# EAGLE schematic VUEQ (2) v31 (EAGLE 9.7.0)
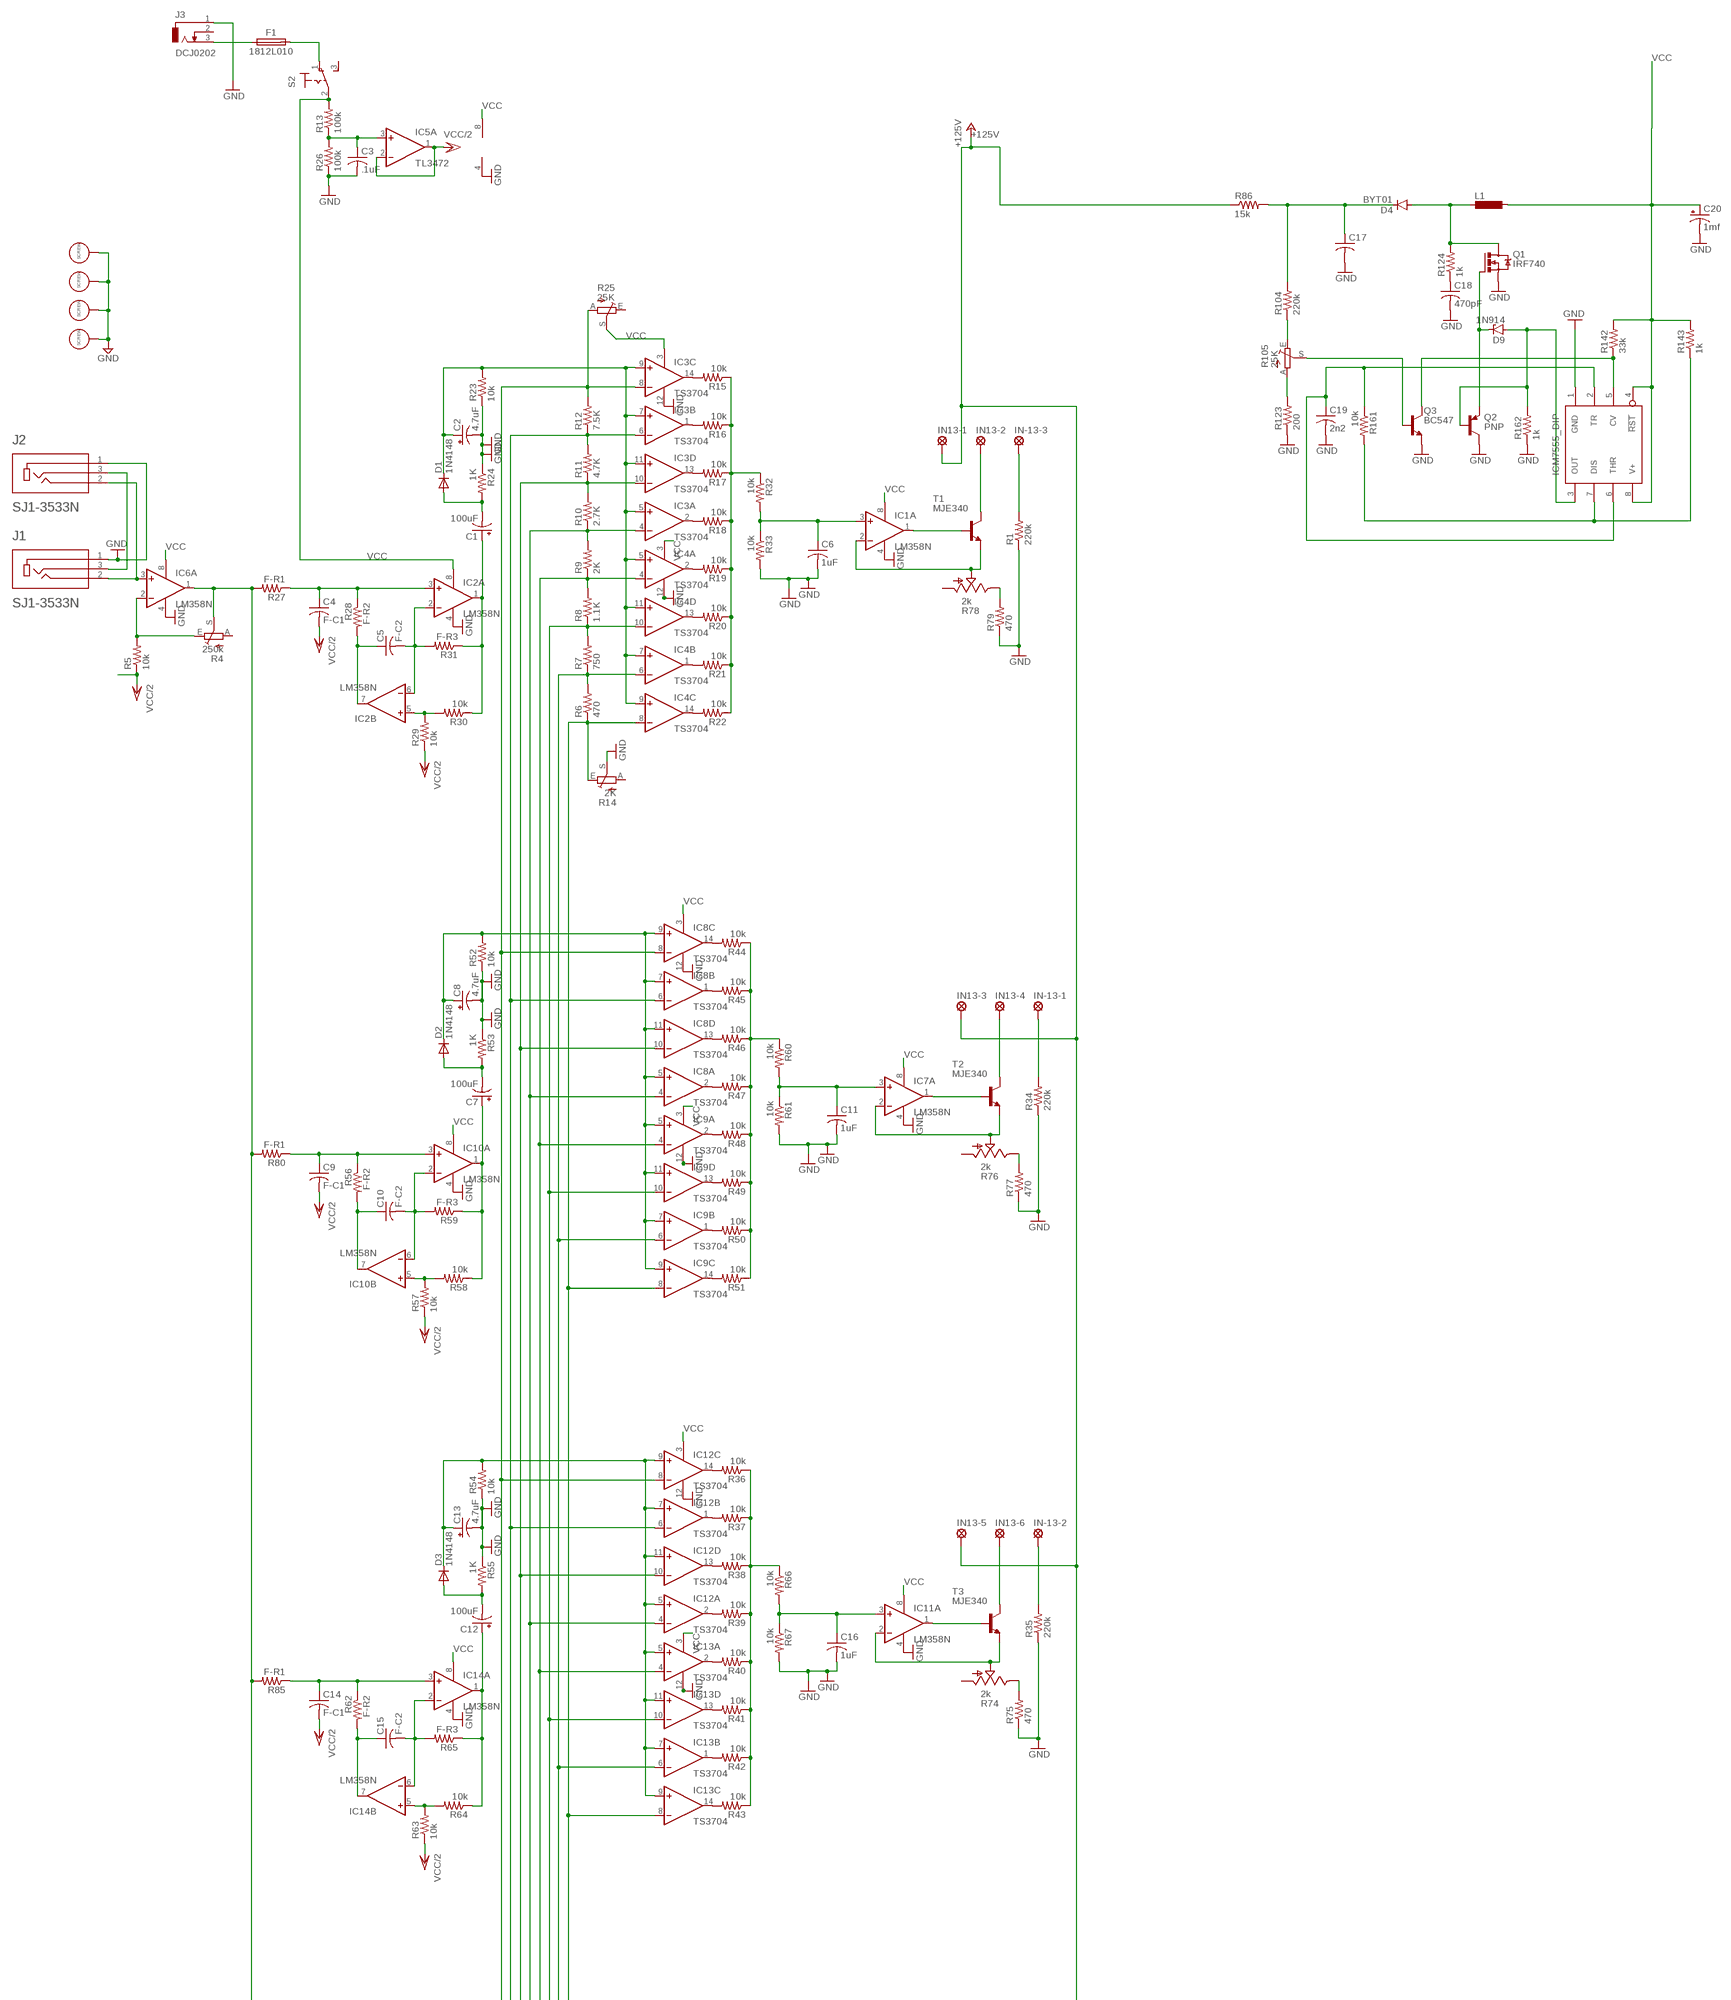
[diagram p0: schematic, sheet 1, part 1 of 3]
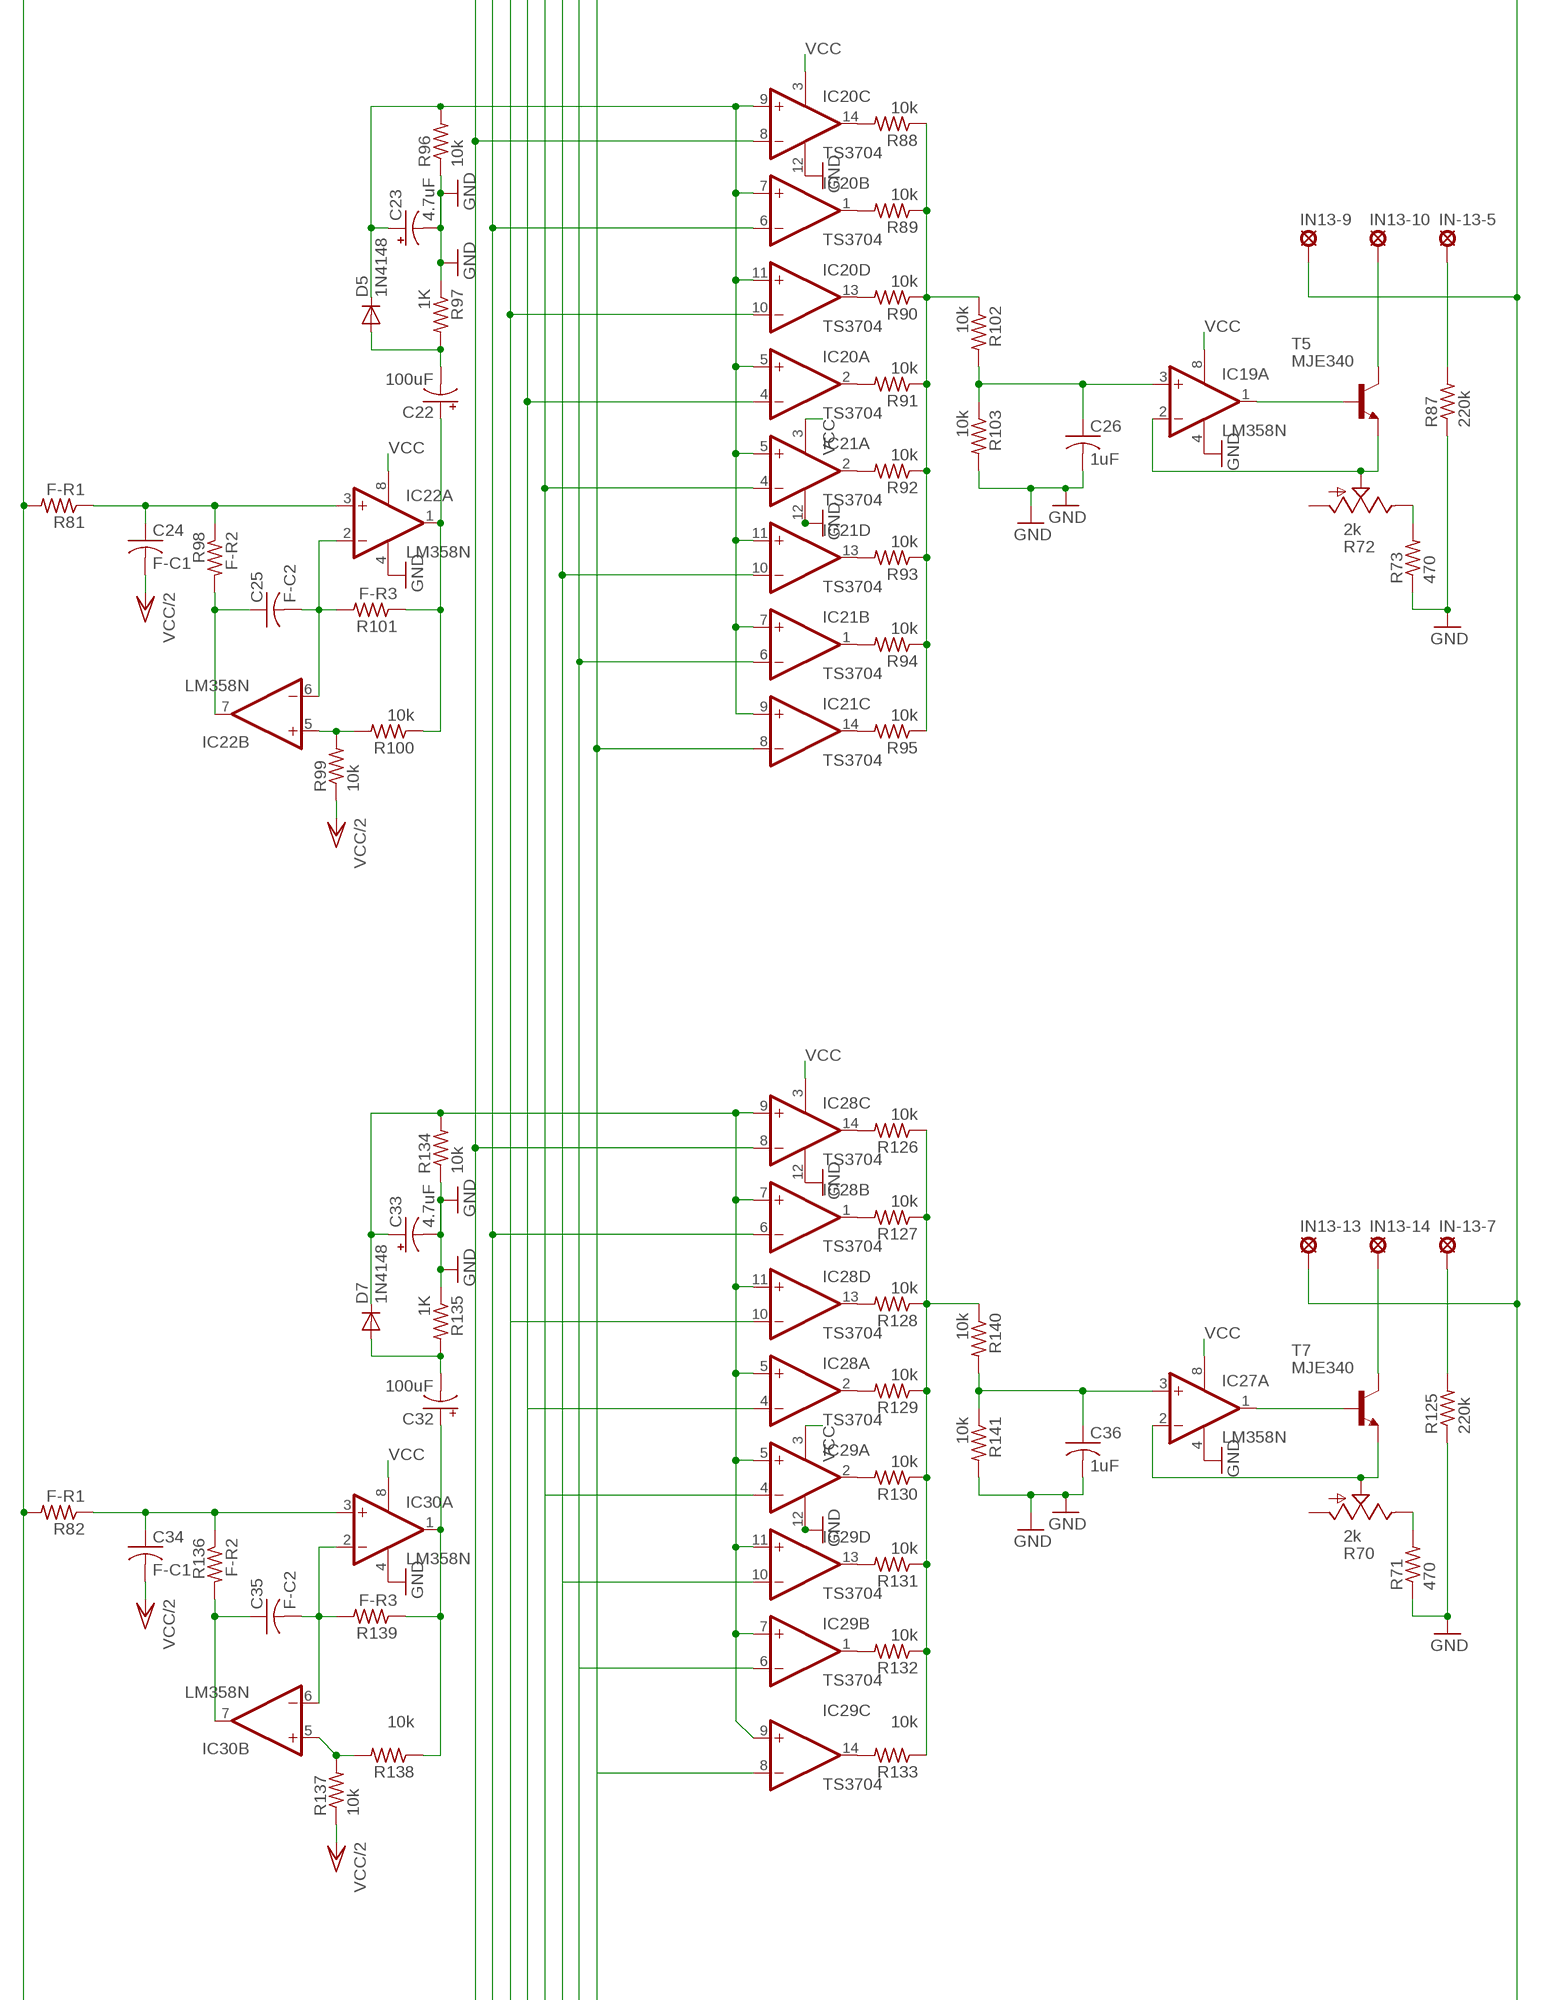
[diagram p1: schematic, sheet 1, part 2 of 3]
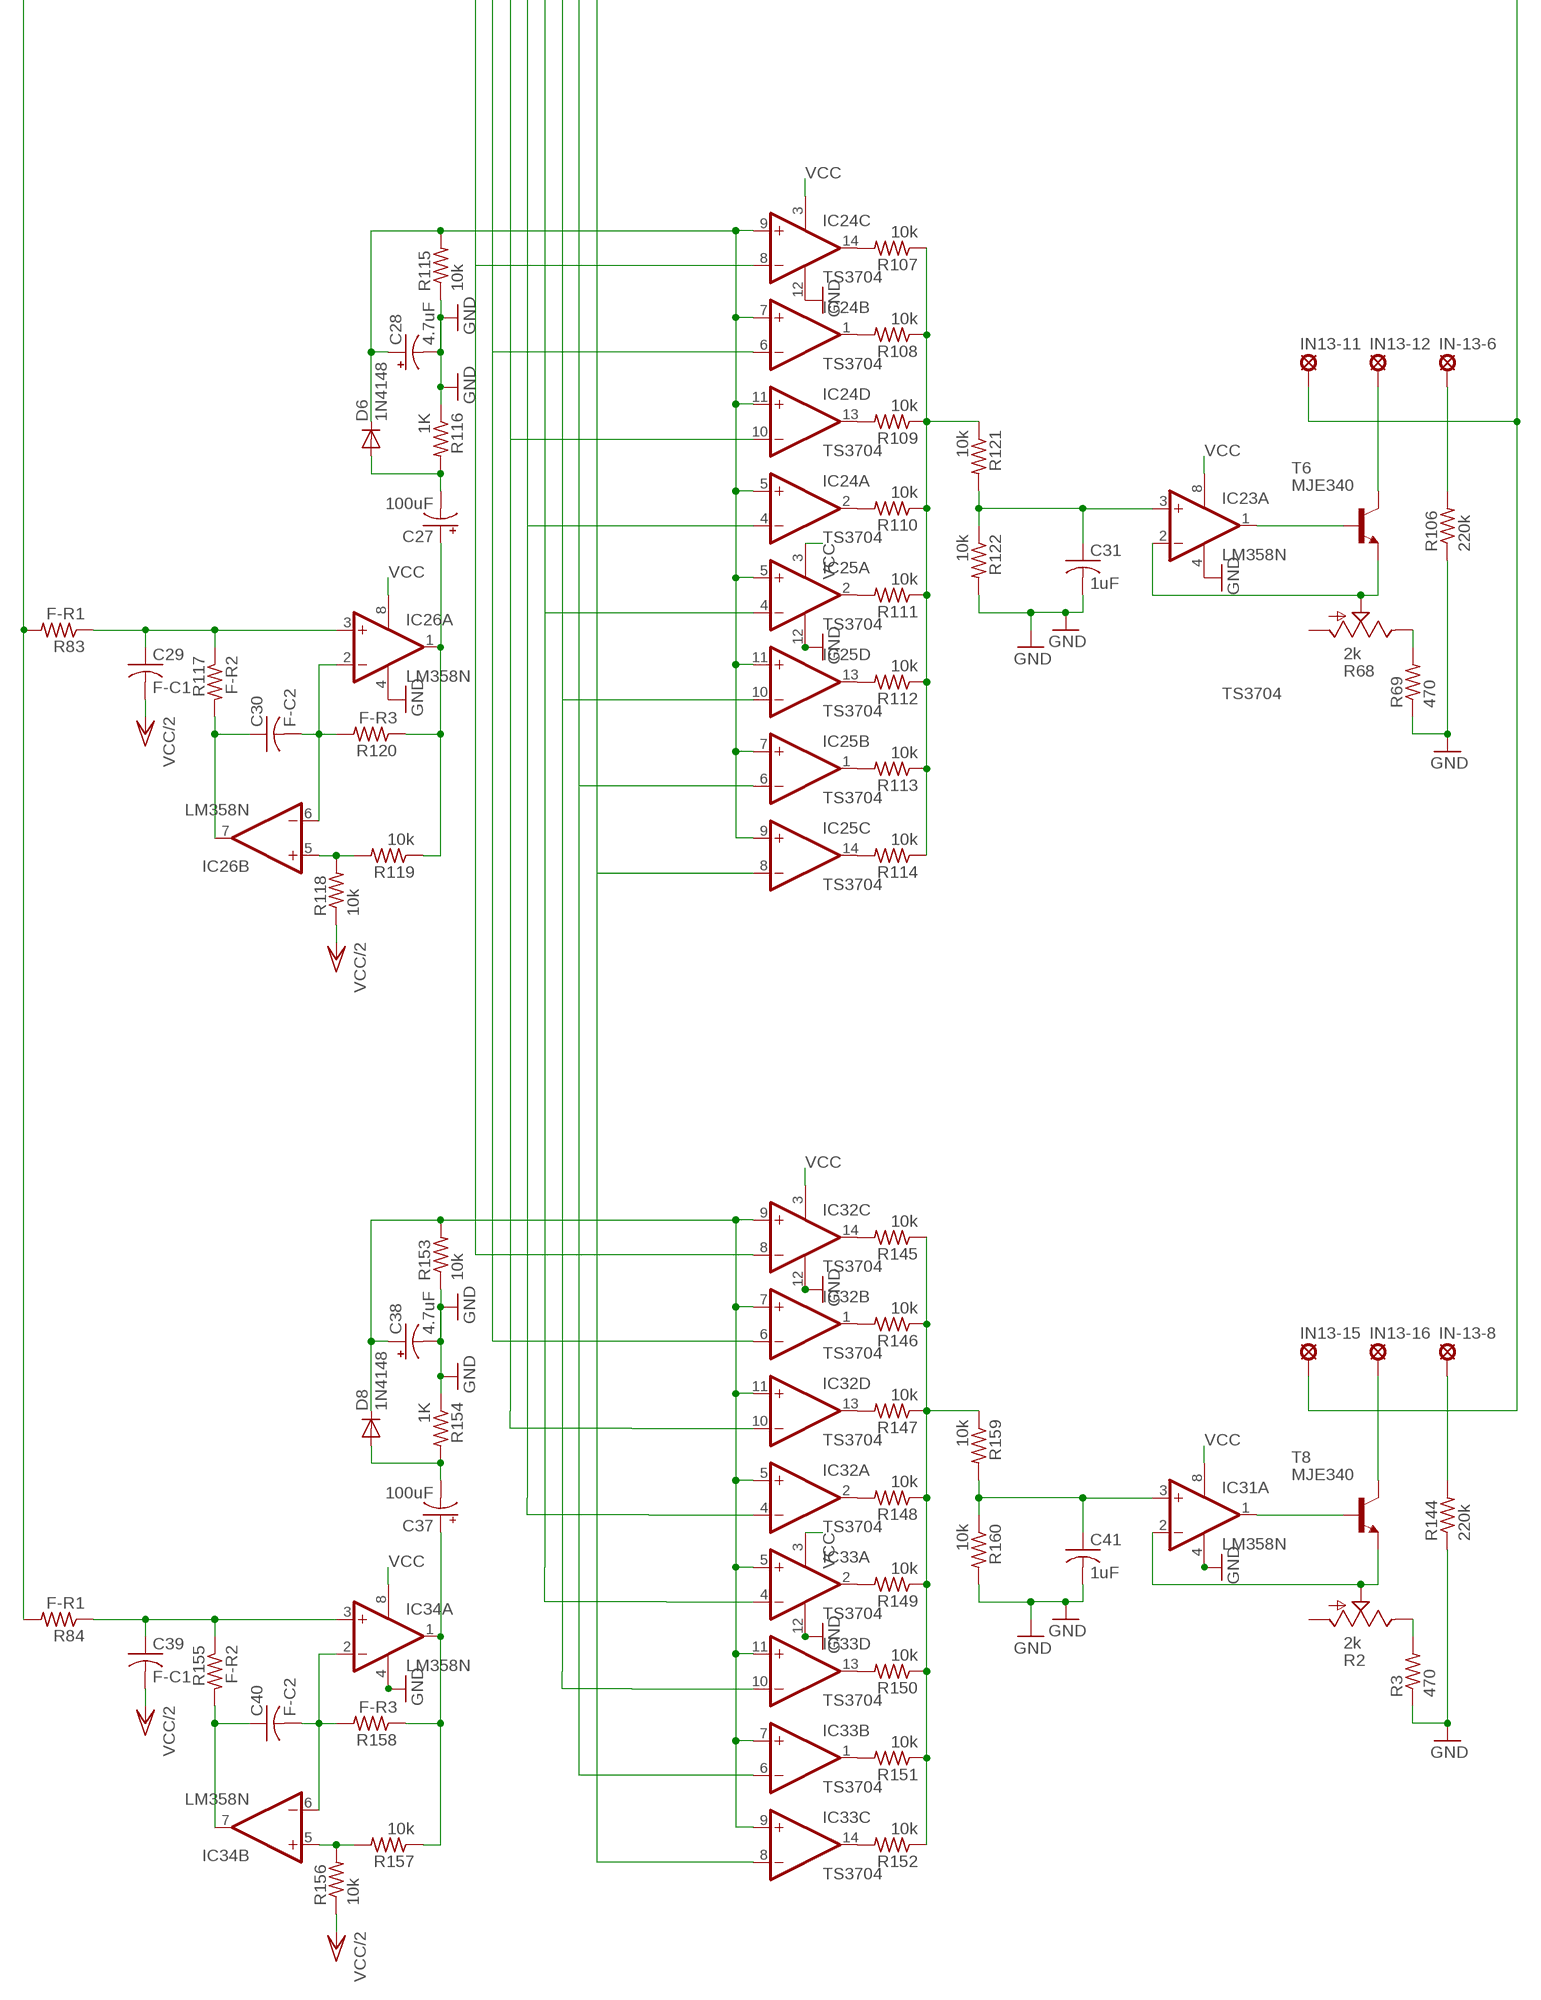
[diagram p2: schematic, sheet 1, part 3 of 3]

## Parts
C1  100uF  CPOL-USE2.5-5  [E2,5-5]
C2  4.7uF  CPOL-USE1.8-4  [E1,8-4]
C3  .1uF  C-US025-025X050  [C025-025X050]
C4  F-C1  C-US025-025X050  [C025-025X050]
C5  F-C2  C-US025-025X050  [C025-025X050]
C6  1uF  C-US025-024X044  [C025-024X044]
C7  100uF  CPOL-USE2.5-5  [E2,5-5]
C8  4.7uF  CPOL-USE1.8-4  [E1,8-4]
C9  F-C1  C-US025-025X050  [C025-025X050]
C10  F-C2  C-US025-025X050  [C025-025X050]
C11  1uF  C-US025-024X044  [C025-024X044]
C12  100uF  CPOL-USE2.5-5  [E2,5-5]
C13  4.7uF  CPOL-USE1.8-4  [E1,8-4]
C14  F-C1  C-US025-025X050  [C025-025X050]
C15  F-C2  C-US025-025X050  [C025-025X050]
C16  1uF  C-US025-024X044  [C025-024X044]
C17  4.7uF 350V  ECA-1EM102  [CAP_RADIAL_5MM]
C18  470pF  C-US025-024X044  [C025-024X044]
C19  2n2  C-US025-024X044  [C025-024X044]
C20  1mf  1000UF-RADIAL-5MM-35V-20%-KIT  [CPOL-RADIAL-5MM-10MM-KIT]
C22  100uF  CPOL-USE2.5-5  [E2,5-5]
C23  4.7uF  CPOL-USE1.8-4  [E1,8-4]
C24  F-C1  C-US025-025X050  [C025-025X050]
C25  F-C2  C-US025-025X050  [C025-025X050]
C26  1uF  C-US025-024X044  [C025-024X044]
C27  100uF  CPOL-USE2.5-5  [E2,5-5]
C28  4.7uF  CPOL-USE1.8-4  [E1,8-4]
C29  F-C1  C-US025-025X050  [C025-025X050]
C30  F-C2  C-US025-025X050  [C025-025X050]
C31  1uF  C-US025-024X044  [C025-024X044]
C32  100uF  CPOL-USE2.5-5  [E2,5-5]
C33  4.7uF  CPOL-USE1.8-4  [E1,8-4]
C34  F-C1  C-US025-025X050  [C025-025X050]
C35  F-C2  C-US025-025X050  [C025-025X050]
C36  1uF  C-US025-024X044  [C025-024X044]
C37  100uF  CPOL-USE2.5-5  [E2,5-5]
C38  4.7uF  CPOL-USE1.8-4  [E1,8-4]
C39  F-C1  C-US025-025X050  [C025-025X050]
C40  F-C2  C-US025-025X050  [C025-025X050]
C41  1uF  C-US025-024X044  [C025-024X044]
D1  1N4148  DIODE-D-7.5  [D-7.5]
D2  1N4148  DIODE-D-7.5  [D-7.5]
D3  1N4148  DIODE-D-7.5  [D-7.5]
D4  BYT01  [F126-10]
D5  1N4148  DIODE-D-7.5  [D-7.5]
D6  1N4148  DIODE-D-7.5  [D-7.5]
D7  1N4148  DIODE-D-7.5  [D-7.5]
D8  1N4148  DIODE-D-7.5  [D-7.5]
D9  1N914  1N821  [DO35Z10]
F1  1812L010  [FUSC4532X125]
IC1  LM358N  [DIL08]
IC2  LM358N  [DIL08]
IC3  TS3704  TLC339P  [DIL14]
IC4  TS3704  TLC339P  [DIL14]
IC5  TL3472  LM358N  [DIL08]
IC6  LM358N  [DIL08]
IC7  LM358N  [DIL08]
IC8  TS3704  TLC339P  [DIL14]
IC9  TS3704  TLC339P  [DIL14]
IC10  LM358N  [DIL08]
IC11  LM358N  [DIL08]
IC12  TS3704  TLC339P  [DIL14]
IC13  TS3704  TLC339P  [DIL14]
IC14  LM358N  [DIL08]
IC15  ICM7555_DIP  [DIP826W53P254L959H508Q8B]
IC19  LM358N  [DIL08]
IC20  TS3704  TLC339P  [DIL14]
IC21  TS3704  TLC339P  [DIL14]
IC22  LM358N  [DIL08]
IC23  LM358N  [DIL08]
IC24  TS3704  TLC339P  [DIL14]
IC25  TS3704  TLC339P  [DIL14]
IC26  LM358N  [DIL08]
IC27  LM358N  [DIL08]
IC28  TS3704  TLC339P  [DIL14]
IC29  TS3704  TLC339P  [DIL14]
IC30  LM358N  [DIL08]
IC31  LM358N  [DIL08]
IC32  TS3704  TLC339P  [DIL14]
IC33  TS3704  TLC339P  [DIL14]
IC34  LM358N  [DIL08]
IN13-1  SE14  [SE14]
IN13-2  SE14  [SE14]
IN13-3  SE14  [SE14]
IN13-4  SE14  [SE14]
IN13-5  SE14  [SE14]
IN13-6  SE14  [SE14]
IN13-9  SE14  [SE14]
IN13-10  SE14  [SE14]
IN13-11  SE14  [SE14]
IN13-12  SE14  [SE14]
IN13-13  SE14  [SE14]
IN13-14  SE14  [SE14]
IN13-15  SE14  [SE14]
IN13-16  SE14  [SE14]
IN-13-1  SE14  [SE14]
IN-13-2  SE14  [SE14]
IN-13-3  SE14  [SE14]
IN-13-5  SE14  [SE14]
IN-13-6  SE14  [SE14]
IN-13-7  SE14  [SE14]
IN-13-8  SE14  [SE14]
J1  SJ1-3533N  [CUI_SJ1-3533N]
J2  SJ1-3533N  [CUI_SJ1-3533N]
J3  DCJ0202  [DCJ0202]
L1  DO3316P  [DO3316P]
Q1  IRF740  NMOSFET_IRF540-TO220  [TO220BV]
Q2  PNP  PNP_TO92  [TO92]
Q3  BC547  NPN_BC547_TO92  [TO92]
R1  220k  R-US_0204/2V  [0204V]
R2  2k  TRIM_US-B25P  [B25P]
R3  470  R-US_0204/2V  [0204V]
R4  250k  TRIM_EU-B25P  [B25P]
R5  10k  R-US_0204/2V  [0204V]
R6  470  R-US_0204/2V  [0204V]
R7  750  R-US_0204/2V  [0204V]
R8  1.1K  R-US_0204/2V  [0204V]
R9  2K  R-US_0204/2V  [0204V]
R10  2.7K  R-US_0204/2V  [0204V]
R11  4.7K  R-US_0204/2V  [0204V]
R12  7.5K  R-US_0204/2V  [0204V]
R13  100k  R-US_0204/2V  [0204V]
R14  2K  TRIM_EU-B25P  [B25P]
R15  10k  R-US_0204/2V  [0204V]
R16  10k  R-US_0204/2V  [0204V]
R17  10k  R-US_0204/2V  [0204V]
R18  10k  R-US_0204/2V  [0204V]
R19  10k  R-US_0204/2V  [0204V]
R20  10k  R-US_0204/2V  [0204V]
R21  10k  R-US_0204/2V  [0204V]
R22  10k  R-US_0204/2V  [0204V]
R23  10k  R-US_0204/2V  [0204V]
R24  1K  R-US_0204/7  [0204/7]
R25  25K  TRIM_EU-B25P  [B25P]
R26  100k  R-US_0204/2V  [0204V]
R27  F-R1  R-US_0204/2V  [0204V]
R28  F-R2  R-US_0204/2V  [0204V]
R29  10k  R-US_0207/10  [0207/10]
R30  10k  R-US_0204/2V  [0204V]
R31  F-R3  R-US_0204/2V  [0204V]
R32  10k  R-US_0207/10  [0207/10]
R33  10k  R-US_0204/2V  [0204V]
R34  220k  R-US_0204/2V  [0204V]
R35  220k  R-US_0204/2V  [0204V]
R36  10k  R-US_0204/2V  [0204V]
R37  10k  R-US_0204/2V  [0204V]
R38  10k  R-US_0204/2V  [0204V]
R39  10k  R-US_0204/2V  [0204V]
R40  10k  R-US_0204/2V  [0204V]
R41  10k  R-US_0204/2V  [0204V]
R42  10k  R-US_0204/2V  [0204V]
R43  10k  R-US_0204/2V  [0204V]
R44  10k  R-US_0204/2V  [0204V]
R45  10k  R-US_0204/2V  [0204V]
R46  10k  R-US_0204/2V  [0204V]
R47  10k  R-US_0204/2V  [0204V]
R48  10k  R-US_0204/2V  [0204V]
R49  10k  R-US_0204/2V  [0204V]
R50  10k  R-US_0204/2V  [0204V]
R51  10k  R-US_0204/2V  [0204V]
R52  10k  R-US_0204/2V  [0204V]
R53  1K  R-US_0204/7  [0204/7]
R54  10k  R-US_0204/2V  [0204V]
R55  1K  R-US_0204/7  [0204/7]
R56  F-R2  R-US_0204/2V  [0204V]
R57  10k  R-US_0207/10  [0207/10]
R58  10k  R-US_0204/2V  [0204V]
R59  F-R3  R-US_0204/2V  [0204V]
R60  10k  R-US_0207/10  [0207/10]
R61  10k  R-US_0204/2V  [0204V]
R62  F-R2  R-US_0204/2V  [0204V]
R63  10k  R-US_0207/10  [0207/10]
R64  10k  R-US_0204/2V  [0204V]
R65  F-R3  R-US_0204/2V  [0204V]
R66  10k  R-US_0207/10  [0207/10]
R67  10k  R-US_0204/2V  [0204V]
R68  2k  TRIM_US-B25P  [B25P]
R69  470  R-US_0204/2V  [0204V]
R70  2k  TRIM_US-B25P  [B25P]
R71  470  R-US_0204/2V  [0204V]
R72  2k  TRIM_US-B25P  [B25P]
R73  470  R-US_0204/2V  [0204V]
R74  2k  TRIM_US-B25P  [B25P]
R75  470  R-US_0204/2V  [0204V]
R76  2k  TRIM_US-B25P  [B25P]
R77  470  R-US_0204/2V  [0204V]
R78  2k  TRIM_US-B25P  [B25P]
R79  470  R-US_0204/2V  [0204V]
R80  F-R1  R-US_0204/2V  [0204V]
R81  F-R1  R-US_0204/2V  [0204V]
R82  F-R1  R-US_0204/2V  [0204V]
R83  F-R1  R-US_0204/2V  [0204V]
R84  F-R1  R-US_0204/2V  [0204V]
R85  F-R1  R-US_0204/2V  [0204V]
R86  15k  R-US_0207/10  [0207/10]
R87  220k  R-US_0204/2V  [0204V]
R88  10k  R-US_0204/2V  [0204V]
R89  10k  R-US_0204/2V  [0204V]
R90  10k  R-US_0204/2V  [0204V]
R91  10k  R-US_0204/2V  [0204V]
R92  10k  R-US_0204/2V  [0204V]
R93  10k  R-US_0204/2V  [0204V]
R94  10k  R-US_0204/2V  [0204V]
R95  10k  R-US_0204/2V  [0204V]
R96  10k  R-US_0204/2V  [0204V]
R97  1K  R-US_0204/7  [0204/7]
R98  F-R2  R-US_0204/2V  [0204V]
R99  10k  R-US_0207/10  [0207/10]
R100  10k  R-US_0204/2V  [0204V]
R101  F-R3  R-US_0204/2V  [0204V]
R102  10k  R-US_0207/10  [0207/10]
R103  10k  R-US_0204/2V  [0204V]
R104  220k  R-US_0207/10  [0207/10]
R105  25K  TRIM_EU-B25P  [B25P]
R106  220k  R-US_0204/2V  [0204V]
R107  10k  R-US_0204/2V  [0204V]
R108  10k  R-US_0204/2V  [0204V]
R109  10k  R-US_0204/2V  [0204V]
R110  10k  R-US_0204/2V  [0204V]
R111  10k  R-US_0204/2V  [0204V]
R112  10k  R-US_0204/2V  [0204V]
R113  10k  R-US_0204/2V  [0204V]
R114  10k  R-US_0204/2V  [0204V]
R115  10k  R-US_0204/2V  [0204V]
R116  1K  R-US_0204/7  [0204/7]
R117  F-R2  R-US_0204/2V  [0204V]
R118  10k  R-US_0207/10  [0207/10]
R119  10k  R-US_0204/2V  [0204V]
R120  F-R3  R-US_0204/2V  [0204V]
R121  10k  R-US_0207/10  [0207/10]
R122  10k  R-US_0204/2V  [0204V]
R123  200  R-US_0207/10  [0207/10]
R124  1k  R-US_0207/10  [0207/10]
R125  220k  R-US_0204/2V  [0204V]
R126  10k  R-US_0204/2V  [0204V]
R127  10k  R-US_0204/2V  [0204V]
R128  10k  R-US_0204/2V  [0204V]
R129  10k  R-US_0204/2V  [0204V]
R130  10k  R-US_0204/2V  [0204V]
R131  10k  R-US_0204/2V  [0204V]
R132  10k  R-US_0204/2V  [0204V]
R133  10k  R-US_0204/2V  [0204V]
R134  10k  R-US_0204/2V  [0204V]
R135  1K  R-US_0204/7  [0204/7]
R136  F-R2  R-US_0204/2V  [0204V]
R137  10k  R-US_0207/10  [0207/10]
R138  10k  R-US_0204/2V  [0204V]
R139  F-R3  R-US_0204/2V  [0204V]
R140  10k  R-US_0207/10  [0207/10]
R141  10k  R-US_0204/2V  [0204V]
R142  33k  R-US_0207/10  [0207/10]
R143  1k  R-US_0207/10  [0207/10]
R144  220k  R-US_0204/2V  [0204V]
R145  10k  R-US_0204/2V  [0204V]
R146  10k  R-US_0204/2V  [0204V]
R147  10k  R-US_0204/2V  [0204V]
R148  10k  R-US_0204/2V  [0204V]
R149  10k  R-US_0204/2V  [0204V]
R150  10k  R-US_0204/2V  [0204V]
R151  10k  R-US_0204/2V  [0204V]
R152  10k  R-US_0204/2V  [0204V]
R153  10k  R-US_0204/2V  [0204V]
R154  1K  R-US_0204/7  [0204/7]
R155  F-R2  R-US_0204/2V  [0204V]
R156  10k  R-US_0207/10  [0207/10]
R157  10k  R-US_0204/2V  [0204V]
R158  F-R3  R-US_0204/2V  [0204V]
R159  10k  R-US_0207/10  [0207/10]
R160  10k  R-US_0204/2V  [0204V]
R161  10k  R-US_0207/10  [0207/10]
R162  1k  R-US_0207/10  [0207/10]
S2  320-916  [320-916]
T1  MJE340  -NPN-TO126V  [TO126V]
T2  MJE340  -NPN-TO126V  [TO126V]
T3  MJE340  -NPN-TO126V  [TO126V]
T5  MJE340  -NPN-TO126V  [TO126V]
T6  MJE340  -NPN-TO126V  [TO126V]
T7  MJE340  -NPN-TO126V  [TO126V]
T8  MJE340  -NPN-TO126V  [TO126V]
U$1  SCREW_HOLE  [SCREW_HOLE]
U$2  SCREW_HOLE  [SCREW_HOLE]
U$4  SCREW_HOLE  [SCREW_HOLE]
U$5  SCREW_HOLE  [SCREW_HOLE]

## Nets
+125V: IN13-1.MP IN13-3.MP IN13-5.MP IN13-9.MP IN13-11.MP IN13-13.MP IN13-15.MP R86.1
GND: C2.- C3.2 C6.2 C8.- C11.2 C13.- C16.2 C17.2 C18.2 C19.2 C20.- C23.- C26.2 C28.- C31.2 C33.- C36.2 C38.- C41.2 IC1.4(P:V-) IC2.4(P:V-) IC3.12(P:V-) IC4.12(P:V-) IC5.4(P:V-) IC6.4(P:V-) IC7.4(P:V-) IC8.12(P:V-) IC9.12(P:V-) IC10.4(P:V-) IC11.4(P:V-) IC12.12(P:V-) IC13.12(P:V-) IC14.4(P:V-) IC15.1(GND) IC19.4(P:V-) IC20.12(P:V-) IC21.12(P:V-) IC22.4(P:V-) IC23.4(P:V-) IC24.12(P:V-) IC25.12(P:V-) IC26.4(P:V-) IC27.4(P:V-) IC28.12(P:V-) IC29.12(P:V-) IC30.4(P:V-) IC31.4(P:V-) IC32.12(P:V-) IC33.12(P:V-) IC34.4(P:V-) J1.1 J2.1 J3.1 Q1.S Q2.1(C) Q3.1(E) R1.1 R3.1 R14.S R23.1 R24.1 R26.1 R33.2 R34.1 R35.1 R52.1 R53.1 R54.1 R55.1 R61.2 R67.2 R69.1 R71.1 R73.1 R75.1 R77.1 R79.1 R87.1 R96.1 R97.1 R103.2 R106.1 R115.1 R116.1 R122.2 R123.1 R125.1 R134.1 R135.1 R141.2 R144.1 R153.1 R154.1 R160.2 R162.1 U$1.P$1 U$2.P$1 U$4.P$1 U$5.P$1
N$1: IN-13-3.MP R1.2
N$2: IC6.2(A:-IN) R4.E R5.2
N$3: R2.E R3.2
N$4: IN-13-1.MP R34.2
N$5: IN13-2.MP T1.2(C)
N$6: IC1.1(A:OUT) T1.3(B)
N$7: IC6.3(A:+IN) J1.2 J2.2
N$8: IC6.1(A:OUT) R4.S R27.2 R80.2 R81.2 R82.2 R83.2 R84.2 R85.2
N$9: C1.- D1.A R24.2
N$10: C3.1 IC5.3(A:+IN) R13.1 R26.2
N$11: IC4.8(C:-IN) IC9.8(C:-IN) IC13.8(C:-IN) IC21.8(C:-IN) IC25.8(C:-IN) IC29.8(C:-IN) IC33.8(C:-IN) R6.1 R14.E
N$12: C24.1 IC22.3(A:+IN) R81.1 R98.1
N$13: IC3.8(C:-IN) IC8.8(C:-IN) IC12.8(C:-IN) IC20.8(C:-IN) IC24.8(C:-IN) IC28.8(C:-IN) IC32.8(C:-IN) R12.2 R25.A
N$14: IC3.6(B:-IN) IC8.6(B:-IN) IC12.6(B:-IN) IC20.6(B:-IN) IC24.6(B:-IN) IC28.6(B:-IN) IC32.6(B:-IN) R11.2 R12.1
N$15: IC3.10(D:-IN) IC8.10(D:-IN) IC12.10(D:-IN) IC20.10(D:-IN) IC24.10(D:-IN) IC28.10(D:-IN) IC32.10(D:-IN) R10.2 R11.1
N$16: IC3.4(A:-IN) IC8.4(A:-IN) IC12.4(A:-IN) IC20.4(A:-IN) IC24.4(A:-IN) IC28.4(A:-IN) IC32.4(A:-IN) R9.2 R10.1
N$17: IC4.4(A:-IN) IC9.4(A:-IN) IC13.4(A:-IN) IC21.4(A:-IN) IC25.4(A:-IN) IC29.4(A:-IN) IC33.4(A:-IN) R8.2 R9.1
N$18: IC4.10(D:-IN) IC9.10(D:-IN) IC13.10(D:-IN) IC21.10(D:-IN) IC25.10(D:-IN) IC29.10(D:-IN) IC33.10(D:-IN) R7.2 R8.1
N$19: IC4.6(B:-IN) IC9.6(B:-IN) IC13.6(B:-IN) IC21.6(B:-IN) IC25.6(B:-IN) IC29.6(B:-IN) IC33.6(B:-IN) R6.2 R7.1
N$20: C34.1 IC30.3(A:+IN) R82.1 R136.1
N$21: C5.1 IC2.7(B:OUT) R28.2
N$22: IC3.13(D:OUT) R17.2
N$23: IC3.1(B:OUT) R16.2
N$24: IC3.2(A:OUT) R18.2
N$25: IC3.14(C:OUT) R15.2
N$26: IC4.2(A:OUT) R19.2
N$27: IC4.13(D:OUT) R20.2
N$28: IC4.1(B:OUT) R21.2
N$29: IC4.14(C:OUT) R22.2
N$30: R15.1 R16.1 R17.1 R18.1 R19.1 R20.1 R21.1 R22.1 R32.1
N$31: IN13-4.MP T2.2(C)
N$32: C5.2 IC2.2(A:-IN) IC2.6(B:-IN) R31.2
N$33: C2.+ D1.C IC3.5(A:+IN) IC3.7(B:+IN) IC3.9(C:+IN) IC3.11(D:+IN) IC4.5(A:+IN) IC4.7(B:+IN) IC4.9(C:+IN) IC4.11(D:+IN) R23.2
N$34: IC2.5(B:+IN) R29.2 R30.2
N$35: C1.+ IC2.1(A:OUT) R30.1 R31.1
N$36: C6.1 IC1.3(A:+IN) R32.2 R33.1
N$37: IC7.1(A:OUT) T2.3(B)
N$38: C4.1 IC2.3(A:+IN) R27.1 R28.1
N$39: R68.E R69.2
N$40: C39.1 IC34.3(A:+IN) R84.1 R155.1
N$41: C9.1 IC10.3(A:+IN) R56.1 R80.1
N$42: J1.3 J2.3
N$43: C17.1 D4.C R86.2 R104.2
N$44: R104.1 R105.E
N$45: IC15.5(CV) Q3.3(C) R142.1
N$46: IC8.1(B:OUT) R45.2
N$47: IC9.2(A:OUT) R48.2
N$48: R44.1 R45.1 R46.1 R47.1 R48.1 R49.1 R50.1 R51.1 R60.1
N$49: C8.+ D2.C IC8.5(A:+IN) IC8.7(B:+IN) IC8.9(C:+IN) IC8.11(D:+IN) IC9.5(A:+IN) IC9.7(B:+IN) IC9.9(C:+IN) IC9.11(D:+IN) R52.2
N$50: R105.A R123.2
N$51: C10.1 IC10.7(B:OUT) R56.2
N$52: C10.2 IC10.2(A:-IN) IC10.6(B:-IN) R59.2
N$53: IC10.5(B:+IN) R57.2 R58.2
N$54: C7.+ IC10.1(A:OUT) R58.1 R59.1
N$55: C7.- D2.A R53.2
N$56: C11.1 IC7.3(A:+IN) R60.2 R61.1
N$57: C14.1 IC14.3(A:+IN) R62.1 R85.1
N$58: IN-13-2.MP R35.2
N$59: IN13-6.MP T3.2(C)
N$60: IC8.13(D:OUT) R46.2
N$61: IC8.2(A:OUT) R47.2
N$62: IC8.14(C:OUT) R44.2
N$63: IC9.13(D:OUT) R49.2
N$64: IC9.1(B:OUT) R50.2
N$65: IC9.14(C:OUT) R51.2
N$66: IC11.1(A:OUT) T3.3(B)
N$67: IC12.1(B:OUT) R37.2
N$68: IC13.2(A:OUT) R40.2
N$69: R36.1 R37.1 R38.1 R39.1 R40.1 R41.1 R42.1 R43.1 R66.1
N$70: C13.+ D3.C IC12.5(A:+IN) IC12.7(B:+IN) IC12.9(C:+IN) IC12.11(D:+IN) IC13.5(A:+IN) IC13.7(B:+IN) IC13.9(C:+IN) IC13.11(D:+IN) R54.2
N$71: C15.1 IC14.7(B:OUT) R62.2
N$72: C15.2 IC14.2(A:-IN) IC14.6(B:-IN) R65.2
N$73: IC14.5(B:+IN) R63.2 R64.2
N$74: C12.+ IC14.1(A:OUT) R64.1 R65.1
N$75: C12.- D3.A R55.2
N$76: C16.1 IC11.3(A:+IN) R66.2 R67.1
N$77: IC12.13(D:OUT) R38.2
N$78: IC12.2(A:OUT) R39.2
N$79: IC12.14(C:OUT) R36.2
N$80: IC13.13(D:OUT) R41.2
N$81: IC13.1(B:OUT) R42.2
N$82: IC13.14(C:OUT) R43.2
N$83: IC23.2(A:-IN) R68.S T6.1(E)
N$84: D4.A L1.1 Q1.D R124.2
N$85: F1.1 J3.3
N$86: IC20.2(A:OUT) R91.2
N$87: IC20.1(B:OUT) R89.2
N$88: IC20.14(C:OUT) R88.2
N$89: IC20.13(D:OUT) R90.2
N$90: IC21.2(A:OUT) R92.2
N$91: IC21.1(B:OUT) R94.2
N$92: IC21.14(C:OUT) R95.2
N$93: IC21.13(D:OUT) R93.2
N$94: IC28.2(A:OUT) R129.2
N$95: IC28.1(B:OUT) R127.2
N$96: IC28.14(C:OUT) R126.2
N$97: IC28.13(D:OUT) R128.2
N$98: IC29.2(A:OUT) R130.2
N$99: IC29.1(B:OUT) R132.2
N$100: IC29.14(C:OUT) R133.2
N$101: IC29.13(D:OUT) R131.2
N$102: IC24.2(A:OUT) R110.2
N$103: IC24.1(B:OUT) R108.2
N$104: IC24.14(C:OUT) R107.2
N$105: IC24.13(D:OUT) R109.2
N$106: IC25.2(A:OUT) R111.2
N$107: IC25.1(B:OUT) R113.2
N$108: IC25.14(C:OUT) R114.2
N$109: IC25.13(D:OUT) R112.2
N$110: IC32.2(A:OUT) R148.2
N$111: IC32.1(B:OUT) R146.2
N$112: IC32.14(C:OUT) R145.2
N$113: IC32.13(D:OUT) R147.2
N$114: IC33.2(A:OUT) R149.2
N$115: IC33.1(B:OUT) R151.2
N$116: IC33.14(C:OUT) R152.2
N$117: C18.1 R124.1
N$118: IC15.7(DIS) R143.1 R161.2
N$119: C19.1 IC15.2(TR) IC15.6(THR) R161.1
N$120: D9.C Q1.G Q2.3(E)
N$121: D9.A IC15.3(OUT) Q2.2(B) R162.2
N$122: Q3.2(B) R105.S
N$123: F1.2 S2.1(O)
N$126: IN-13-5.MP R87.2
N$127: IN13-10.MP T5.2(C)
N$128: IC19.1(A:OUT) T5.3(B)
N$131: R88.1 R89.1 R90.1 R91.1 R92.1 R93.1 R94.1 R95.1 R102.1
N$132: C23.+ D5.C IC20.5(A:+IN) IC20.7(B:+IN) IC20.9(C:+IN) IC20.11(D:+IN) IC21.5(A:+IN) IC21.7(B:+IN) IC21.9(C:+IN) IC21.11(D:+IN) R96.2
N$133: C25.1 IC22.7(B:OUT) R98.2
N$134: C25.2 IC22.2(A:-IN) IC22.6(B:-IN) R101.2
N$135: IC22.5(B:+IN) R99.2 R100.2
N$136: C22.+ IC22.1(A:OUT) R100.1 R101.1
N$137: C22.- D5.A R97.2
N$138: C26.1 IC19.3(A:+IN) R102.2 R103.1
N$145: R70.E R71.2
N$146: IC27.2(A:-IN) R70.S T7.1(E)
N$147: IC31.2(A:-IN) R2.S T8.1(E)
N$157: IN-13-6.MP R106.2
N$158: IN13-12.MP T6.2(C)
N$159: IC23.1(A:OUT) T6.3(B)
N$162: R107.1 R108.1 R109.1 R110.1 R111.1 R112.1 R113.1 R114.1 R121.1
N$163: C28.+ D6.C IC24.5(A:+IN) IC24.7(B:+IN) IC24.9(C:+IN) IC24.11(D:+IN) IC25.5(A:+IN) IC25.7(B:+IN) IC25.9(C:+IN) IC25.11(D:+IN) R115.2
N$164: C30.1 IC26.7(B:OUT) R117.2
N$165: C30.2 IC26.2(A:-IN) IC26.6(B:-IN) R120.2
N$166: IC26.5(B:+IN) R118.2 R119.2
N$167: C27.+ IC26.1(A:OUT) R119.1 R120.1
N$168: C27.- D6.A R116.2
N$169: C31.1 IC23.3(A:+IN) R121.2 R122.1
N$176: R72.E R73.2
N$177: IC19.2(A:-IN) R72.S T5.1(E)
N$178: R74.E R75.2
N$188: IN-13-7.MP R125.2
N$189: IN13-14.MP T7.2(C)
N$190: IC27.1(A:OUT) T7.3(B)
N$193: R126.1 R127.1 R128.1 R129.1 R130.1 R131.1 R132.1 R133.1 R140.1
N$194: C33.+ D7.C IC28.5(A:+IN) IC28.7(B:+IN) IC28.9(C:+IN) IC28.11(D:+IN) IC29.5(A:+IN) IC29.7(B:+IN) IC29.9(C:+IN) IC29.11(D:+IN) R134.2
N$195: C35.1 IC30.7(B:OUT) R136.2
N$196: C35.2 IC30.2(A:-IN) IC30.6(B:-IN) R139.2
N$197: IC30.5(B:+IN) R137.2 R138.2
N$198: C32.+ IC30.1(A:OUT) R138.1 R139.1
N$199: C32.- D7.A R135.2
N$200: C36.1 IC27.3(A:+IN) R140.2 R141.1
N$207: IC11.2(A:-IN) R74.S T3.1(E)
N$208: R76.E R77.2
N$209: IC7.2(A:-IN) R76.S T2.1(E)
N$218: C29.1 IC26.3(A:+IN) R83.1 R117.1
N$219: IN-13-8.MP R144.2
N$220: IN13-16.MP T8.2(C)
N$221: IC31.1(A:OUT) T8.3(B)
N$224: R145.1 R146.1 R147.1 R148.1 R149.1 R150.1 R151.1 R152.1 R159.1
N$225: C38.+ D8.C IC32.5(A:+IN) IC32.7(B:+IN) IC32.9(C:+IN) IC32.11(D:+IN) IC33.5(A:+IN) IC33.7(B:+IN) IC33.9(C:+IN) IC33.11(D:+IN) R153.2
N$226: C40.1 IC34.7(B:OUT) R155.2
N$227: C40.2 IC34.2(A:-IN) IC34.6(B:-IN) R158.2
N$228: IC34.5(B:+IN) R156.2 R157.2
N$229: C37.+ IC34.1(A:OUT) R157.1 R158.1
N$230: C37.- D8.A R154.2
N$231: C41.1 IC31.3(A:+IN) R159.2 R160.1
N$238: R78.E R79.2
N$239: IC1.2(A:-IN) R78.S T1.1(E)
N$241: IC33.13(D:OUT) R150.2
VCC: C20.+ IC1.8(P:V+) IC2.8(P:V+) IC3.3(P:V+) IC4.3(P:V+) IC5.8(P:V+) IC6.8(P:V+) IC7.8(P:V+) IC8.3(P:V+) IC9.3(P:V+) IC10.8(P:V+) IC11.8(P:V+) IC12.3(P:V+) IC13.3(P:V+) IC14.8(P:V+) IC15.4(!RST) IC15.8(V+) IC19.8(P:V+) IC20.3(P:V+) IC21.3(P:V+) IC22.8(P:V+) IC23.8(P:V+) IC24.3(P:V+) IC25.3(P:V+) IC26.8(P:V+) IC27.8(P:V+) IC28.3(P:V+) IC29.3(P:V+) IC30.8(P:V+) IC31.8(P:V+) IC32.3(P:V+) IC33.3(P:V+) IC34.8(P:V+) L1.2 R13.2 R25.S R142.2 R143.2 S2.2(P)
VCC/2: C4.2 C9.2 C14.2 C24.2 C29.2 C34.2 C39.2 IC5.1(A:OUT) IC5.2(A:-IN) R5.1 R29.1 R57.1 R63.1 R99.1 R118.1 R137.1 R156.1
Unconnected: IC1.5(B:+IN) IC1.6(B:-IN) IC1.7(B:OUT) IC5.5(B:+IN) IC5.6(B:-IN) IC5.7(B:OUT) IC6.5(B:+IN) IC6.6(B:-IN) IC6.7(B:OUT) IC7.5(B:+IN) IC7.6(B:-IN) IC7.7(B:OUT) IC11.5(B:+IN) IC11.6(B:-IN) IC11.7(B:OUT) IC19.5(B:+IN) IC19.6(B:-IN) IC19.7(B:OUT) IC23.5(B:+IN) IC23.6(B:-IN) IC23.7(B:OUT) IC27.5(B:+IN) IC27.6(B:-IN) IC27.7(B:OUT) IC31.5(B:+IN) IC31.6(B:-IN) IC31.7(B:OUT) J3.2 R2.A R4.A R14.A R25.E R68.A R70.A R72.A R74.A R76.A R78.A S2.3(S)

## Library data of the parts
C1 C2 C7 C8 C12 C13 C22 C23 C27 C28 C32 C33 C37 C38 = rcl:CPOL-US: POLARIZED CAPACITOR, American symbol
C3-C6 C9-C11 C14-C16 C18 C19 C24-C26 C29-C31 C34-C36 C39-C41 = rcl:C-US: CAPACITOR, American symbol
C17 = Resistor_Capacitor:ECA-1EM102: CAP ALUM 1000UF 20% 25V RADIAL Manufacturer's datasheet <https://media.digikey.com/pdf/Data%20Sheets/Panasonic%20Electronic%20Components/ECA-xxM%20Series,TypeA.pdf>; CREATED_BY: PCBLayout.com; DIGIKEY_PART_NUMBER: P5156-ND; MANUFACTURER: Panasonic Electronic Components; MPN: ECA-1EM102; PACKAGE: CAP RADIAL 5MM LS
C20 = SparkFun-Capacitors:1000UF: 1,000µF/1mF ceramic capacitors A capacitor is a passive two-terminal electrical component used to store electrical energy temporarily in an electric field. CAP-08070; PROD_ID: CAP-09538
D1-D3 D5-D8 = diode:DIODE-: DIODE
D4 = diode:BYT01: DIODE ultra fast
D9 = diode:1N821: Reference DIODE temperature compensated, 6,2 V
F1 = Fuse:1812L: 1812L Series PTC provides surface mount overcurrent protection for applications where resettable protection is desired. Datasheet <https://www.littelfuse.com/~/media/electronics/datasheets/resettable_ptcs/littelfuse_ptc_1812l_datasheet.pdf.pdf>; CATEGORY: FUSE; DESCRIPTION: Resettable PTCs; MANUFACTURER: Littlefuse; MPN: 1812L010; OPERATING_TEMPERATURE: -40°C to +85°C; PART_STATUS: ACTIVE; ROHS_COMPLIANCE: RoHS Compliant; SERIES: 1812L; SUBCATEGORY: Resettable; TYPE: PTC
IC1 IC2 IC5-IC7 IC10 IC11 IC14 IC19 IC22 IC23 IC26 IC27 IC30 IC31 IC34 = linear:LM358: OP AMP also LM158; LM258; LM2904 Source: http://cache.national.com/ds/LM/LM158.pdf
IC3 IC4 IC8 IC9 IC12 IC13 IC20 IC21 IC24 IC25 IC28 IC29 IC32 IC33 = linear:TLC339: COMPARATOR
IC15 = IC_Clock-Timing:*555: TIMER 555 General purpose precision timers NE555 : Texas Datasheet <http://www.ti.com/general/docs/suppproductinfo.tsp?distId=10&gotoUrl=http%3A%2F%2Fwww.ti.com%2Flit%2Fgpn%2Fne555>, Diodes Incorporated Datasheet <https://www.diodes.com/assets/Datasheets/NE555_SA555_NA555.pdf> LM555 Datasheet <http://www.ti.com/general/docs/suppproductinfo.tsp?distId=10&gotoUrl=http%3A%2F%2Fwww.ti.com%2Flit%2Fgpn%2Flm555> LMC555 Datasheet <http://www.ti.com/general/docs/suppproductinfo.tsp?distId=10&gotoUrl=http%3A%2F%2Fwww.ti.com%2Flit%2Fgpn%2Flmc555> ICM7555 : Maxim Integrated Datasheet <https://datasheets.maximintegrated.com/en/ds/ICM7555-ICM7556.pdf>, Renesas Electronics America Inc Datasheet <https://www.renesas.com/en-us/www/doc/datasheet/icm7555-56.pdf>; CATEGORY: IC_Clock-Timing; CURRENT-SUPPLY: 60µA; DESCRIPTION: IC OSC SINGLE TIMER 1MHZ 8DIP; FREQUENCY: 1MHz; MANUFACTURER: Renesas Electronics America Inc; MPN: ICM7555IPAZ; OPERATING_TEMP: -25°C to 85°C; PART_STATUS: Active; ROHS_COMPLIANT: ROHS3 Compliant; SUB-CATEGORY: Timer
IN13-1-IN13-6 IN13-9-IN13-16 IN-13-1-IN-13-3 IN-13-5-IN-13-8 = solpad:SE14: SOLDER PAD E1553, drill 1,4mm, distributor Buerklin, 07F820
J1 J2 = Switch:SJ1-3533N: 3.5 mm Right-Angle Stereo Jack, 3 Pin PCB Mount, Non-Threaded; AVAILABILITY: Good; DESCRIPTION: SJ1 Series 3.5 mm 12 V Right Angle Through Hole Stereo Audio Jack; MF: CUI; MP: SJ1-3533N; PACKAGE: None; PRICE: 0.88 USD
J3 = con-jack:DCJ0202: DC POWER JACK Source: DCJ0202.pdf; OC_FARNELL: unknown; OC_NEWARK: unknown
L1 = inductor-coilcraft:DO3316P: COILCRAFT; OC_FARNELL: unknown; OC_NEWARK: unknown
Q1 = transistor:NMOSFET_: N-Channel MOSFET - Popular parts; CATEGORY: Transistor; DESCRIPTION: MOSFET N-CH 100V 33A TO-220AB; DRAIN_CURRENT: 33A; MANUFACTURER: Infineon Technologies; MPN: IRF540NPBF; OPERATING_TEMP: -55°C ~ 175°C; PART_STATUS: Active; ROHS_COMPLIANT: Yes; SUB-CATEGORY: MOSFET; THERMALLOSS: 130W; TYPE: N-Channel; VALUE: IRF540
Q2 = transistor:PNP: PNP - Generic; CATEGORY: Transistor; SUB-CATEGORY: BJT; TYPE: PNP
Q3 = transistor:NPN_: NPN - Popular parts; CATEGORY: Transistor; SUB-CATEGORY: BJT; TYPE: NPN
R1 R3 R5-R13 R15-R24 R26-R67 R69 R71 R73 R75 R77 R79-R104 R106-R162 = rcl:R-US_: RESISTOR, American symbol
R2 R68 R70 R72 R74 R76 R78 = pot:TRIM_US-: POTENTIOMETER
R4 R14 R25 R105 = pot:TRIM_EU-: POTENTIOMETER
S2 = switch:320-916: TOGGLE SWITCH distributor RS Components
T1-T3 T5-T8 = transistor:*-NPN-: NPN Transistror
U$1 U$2 U$4 U$5 = Dean:SCREW_HOLE